# EAGLE design PhasedArrayTransmittor (EAGLE 9.5.2)
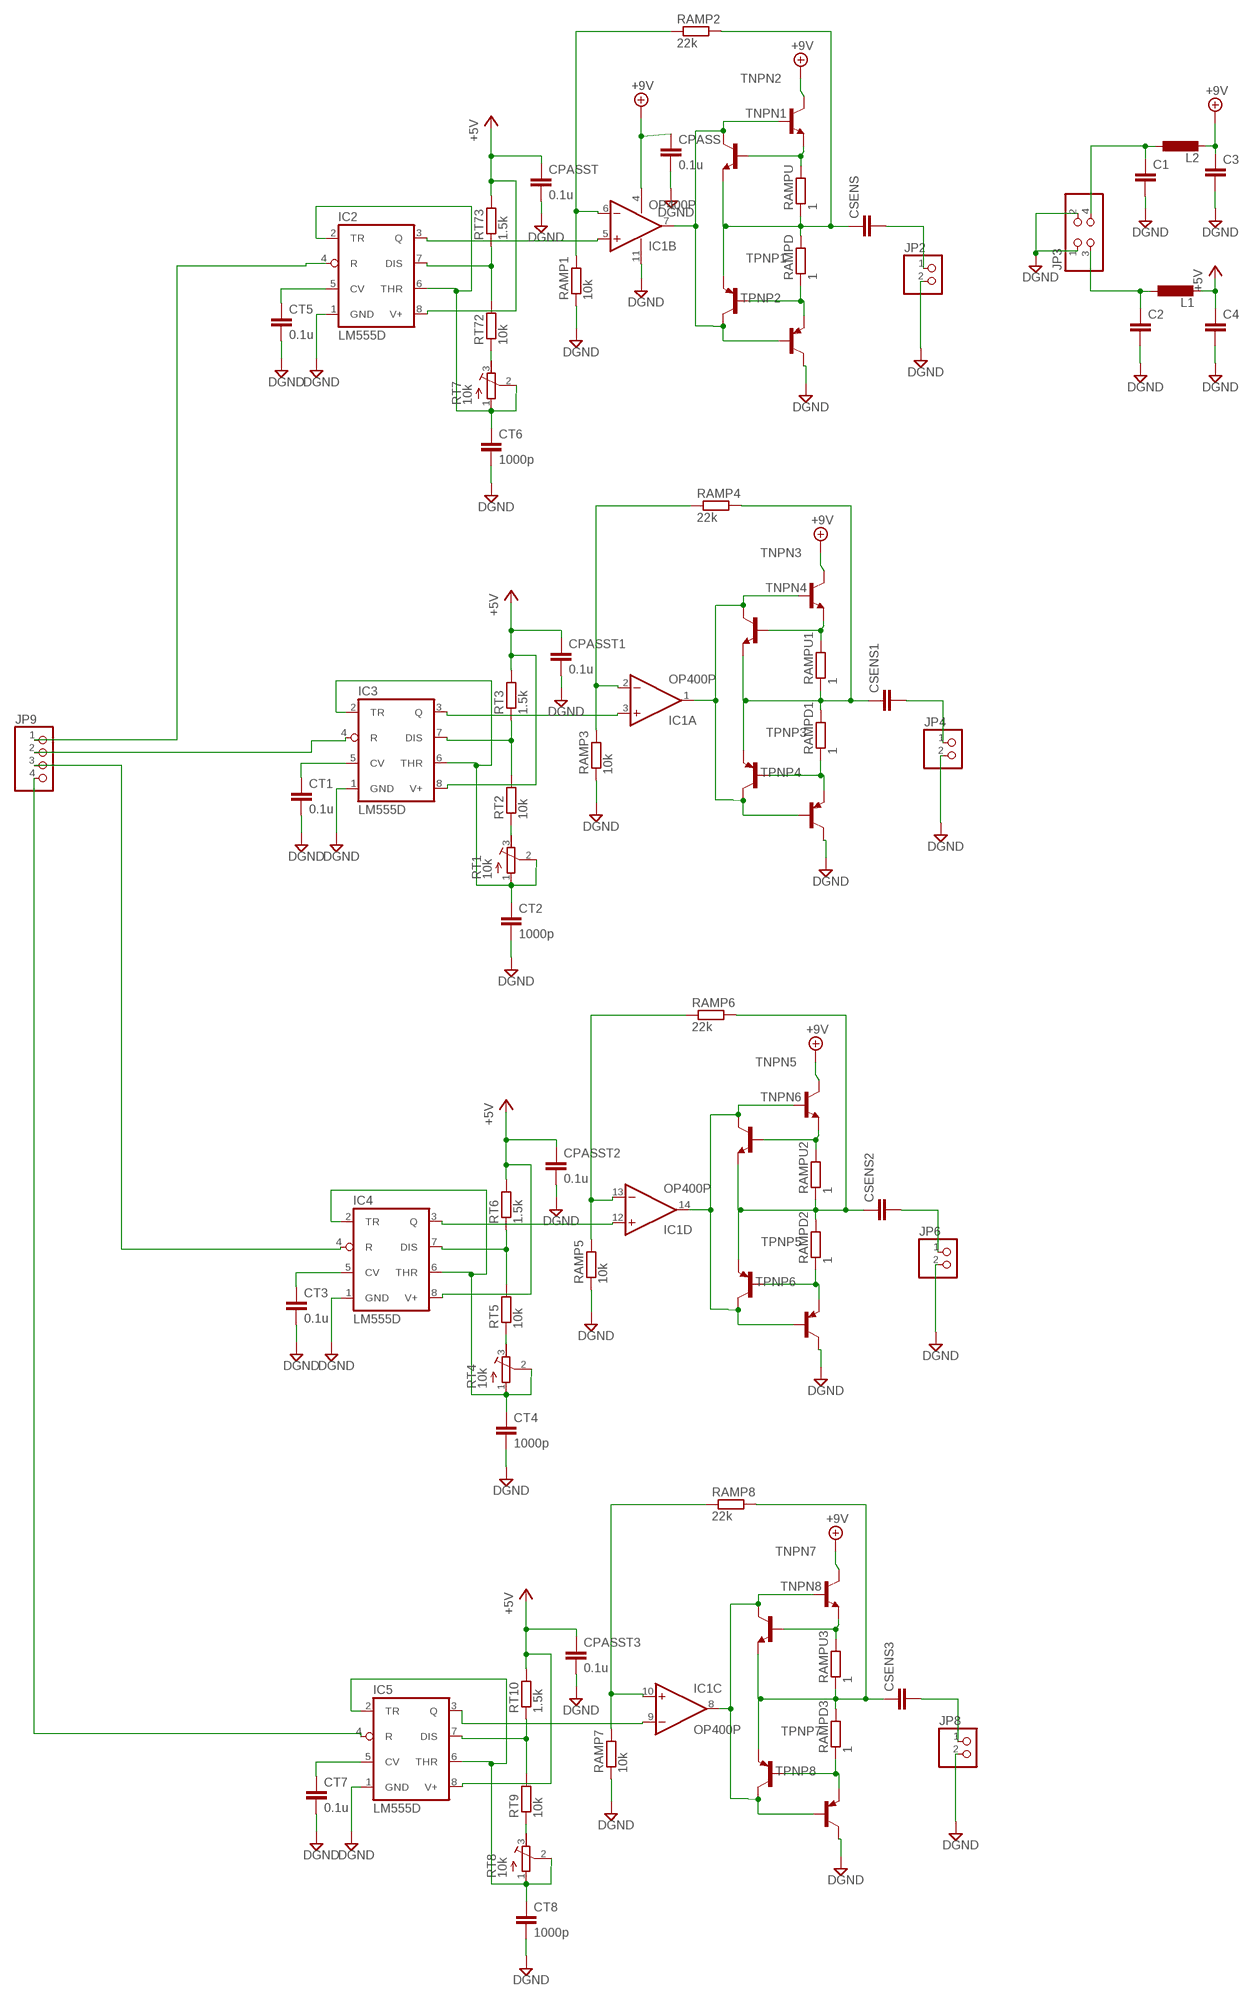
[diagram p0: schematic, sheet 1]

## Parts
C1  C-EU025-024X044  [C025-024X044]
C2  C-EU025-024X044  [C025-024X044]
C3  C-EU025-024X044  [C025-024X044]
C4  C-EU025-024X044  [C025-024X044]
CPASS  0.1u  C-EUC0603K  [C0603K]
CPASST  0.1u  C-EU025-024X044  [C025-024X044]
CPASST1  0.1u  C-EU025-024X044  [C025-024X044]
CPASST2  0.1u  C-EU025-024X044  [C025-024X044]
CPASST3  0.1u  C-EU025-024X044  [C025-024X044]
CSENS  C-EUC0603K  [C0603K]
CSENS1  C-EUC0603K  [C0603K]
CSENS2  C-EUC0603K  [C0603K]
CSENS3  C-EUC0603K  [C0603K]
CT1  0.1u  C-EU025-024X044  [C025-024X044]
CT2  1000p  C-EU025-024X044  [C025-024X044]
CT3  0.1u  C-EU025-024X044  [C025-024X044]
CT4  1000p  C-EU025-024X044  [C025-024X044]
CT5  0.1u  C-EU025-024X044  [C025-024X044]
CT6  1000p  C-EU025-024X044  [C025-024X044]
CT7  0.1u  C-EU025-024X044  [C025-024X044]
CT8  1000p  C-EU025-024X044  [C025-024X044]
IC1  OP400P  [DIL14]
IC2  LM555D  [SO08]
IC3  LM555D  [SO08]
IC4  LM555D  [SO08]
IC5  LM555D  [SO08]
JP2  PINHD-1X2  [1X02]
JP3  PINHD-2X2  [2X02]
JP4  PINHD-1X2  [1X02]
JP6  PINHD-1X2  [1X02]
JP8  PINHD-1X2  [1X02]
JP9  PINHD-1X4  [1X04]
L1  L-EU0207/7  [0207/7]
L2  L-EU0207/7  [0207/7]
RAMP1  10k  R-EU_R0603  [R0603]
RAMP2  22k  R-EU_R0603  [R0603]
RAMP3  10k  R-EU_R0603  [R0603]
RAMP4  22k  R-EU_R0603  [R0603]
RAMP5  10k  R-EU_R0603  [R0603]
RAMP6  22k  R-EU_R0603  [R0603]
RAMP7  10k  R-EU_R0603  [R0603]
RAMP8  22k  R-EU_R0603  [R0603]
RAMPD  1  R-EU_R0603  [R0603]
RAMPD1  1  R-EU_R0603  [R0603]
RAMPD2  1  R-EU_R0603  [R0603]
RAMPD3  1  R-EU_R0603  [R0603]
RAMPU  1  R-EU_R0603  [R0603]
RAMPU1  1  R-EU_R0603  [R0603]
RAMPU2  1  R-EU_R0603  [R0603]
RAMPU3  1  R-EU_R0603  [R0603]
RT1  10k  R-TRIMM74W  [RTRIM74W]
RT2  10k  R-EU_R0603  [R0603]
RT3  1.5k  R-EU_R0603  [R0603]
RT4  10k  R-TRIMM74W  [RTRIM74W]
RT5  10k  R-EU_R0603  [R0603]
RT6  1.5k  R-EU_R0603  [R0603]
RT7  10k  R-TRIMM74W  [RTRIM74W]
RT8  10k  R-TRIMM74W  [RTRIM74W]
RT9  10k  R-EU_R0603  [R0603]
RT10  1.5k  R-EU_R0603  [R0603]
RT72  10k  R-EU_R0603  [R0603]
RT73  1.5k  R-EU_R0603  [R0603]
TNPN1  BC817-16-NPN-SOT23-BEC  [SOT23-BEC]
TNPN2  BC817-16-NPN-SOT23-BEC  [SOT23-BEC]
TNPN3  BC817-16-NPN-SOT23-BEC  [SOT23-BEC]
TNPN4  BC817-16-NPN-SOT23-BEC  [SOT23-BEC]
TNPN5  BC817-16-NPN-SOT23-BEC  [SOT23-BEC]
TNPN6  BC817-16-NPN-SOT23-BEC  [SOT23-BEC]
TNPN7  BC817-16-NPN-SOT23-BEC  [SOT23-BEC]
TNPN8  BC817-16-NPN-SOT23-BEC  [SOT23-BEC]
TPNP1  BC807-16-PNP-SOT23-BEC  [SOT23-BEC]
TPNP2  BC807-16-PNP-SOT23-BEC  [SOT23-BEC]
TPNP3  BC807-16-PNP-SOT23-BEC  [SOT23-BEC]
TPNP4  BC807-16-PNP-SOT23-BEC  [SOT23-BEC]
TPNP5  BC807-16-PNP-SOT23-BEC  [SOT23-BEC]
TPNP6  BC807-16-PNP-SOT23-BEC  [SOT23-BEC]
TPNP7  BC807-16-PNP-SOT23-BEC  [SOT23-BEC]
TPNP8  BC807-16-PNP-SOT23-BEC  [SOT23-BEC]

## Nets
+5V [power]: C4.1 CPASST1.1 CPASST2.1 CPASST3.1 CPASST.1 IC2.8(V+) IC3.8(V+) IC4.8(V+) IC5.8(V+) L1.2 RT3.2 RT6.2 RT10.2 RT73.2
+9V [power]: C3.1 CPASS.1 IC1.4(P:V+) L2.2 TNPN2.C TNPN3.C TNPN5.C TNPN7.C
DGND [power]: C1.2 C2.2 C3.2 C4.2 CPASS.2 CPASST1.2 CPASST2.2 CPASST3.2 CPASST.2 CT1.2 CT2.2 CT3.2 CT4.2 CT5.2 CT6.2 CT7.2 CT8.2 IC1.11(P:V-) IC2.1(GND) IC3.1(GND) IC4.1(GND) IC5.1(GND) JP2.2 JP3.1 JP3.2 JP4.2 JP6.2 JP8.2 RAMP1.1 RAMP3.1 RAMP5.1 RAMP7.1 TPNP2.C TPNP4.C TPNP6.C TPNP8.C
N$1: RT1.3(E) RT2.1
N$2: CT5.1 IC2.5(CV)
N$3: RT7.3(E) RT72.1
N$4: IC1.6(B:-IN) RAMP1.2 RAMP2.1
N$5: IC2.7(DIS) RT72.2 RT73.1
N$6: IC5.4(R) JP9.4
N$7: IC1.7(B:OUT) TNPN1.C TNPN2.B TPNP1.C TPNP2.B
N$8: CT6.1 IC2.2(TR) IC2.6(THR) RT7.1(A) RT7.2(S)
N$9: IC3.7(DIS) RT2.2 RT3.1
N$10: RAMPD.1 TPNP1.B TPNP2.E
N$11: IC4.4(R) JP9.3
N$12: CT2.1 IC3.2(TR) IC3.6(THR) RT1.1(A) RT1.2(S)
N$13: RAMPU.2 TNPN1.B TNPN2.E
N$14: CSENS.1 RAMP2.2 RAMPD.2 RAMPU.1 TNPN1.E TPNP1.E
N$15: IC1.2(A:-IN) RAMP3.2 RAMP4.1
N$16: CSENS.2 JP2.1
N$17: RAMPU1.2 TNPN3.E TNPN4.B
N$18: IC1.1(A:OUT) TNPN3.B TNPN4.C TPNP3.C TPNP4.B
N$19: RAMPD1.1 TPNP3.B TPNP4.E
N$20: CSENS1.1 RAMP4.2 RAMPD1.2 RAMPU1.1 TNPN4.E TPNP3.E
N$21: CSENS1.2 JP4.1
N$22: CT1.1 IC3.5(CV)
N$23: RT4.3(E) RT5.1
N$24: IC4.7(DIS) RT5.2 RT6.1
N$25: IC3.4(R) JP9.2
N$26: CT4.1 IC4.2(TR) IC4.6(THR) RT4.1(A) RT4.2(S)
N$27: IC1.13(D:-IN) RAMP5.2 RAMP6.1
N$28: RAMPU2.2 TNPN5.E TNPN6.B
N$29: IC1.14(D:OUT) TNPN5.B TNPN6.C TPNP5.C TPNP6.B
N$30: RAMPD2.1 TPNP5.B TPNP6.E
N$31: CSENS2.1 RAMP6.2 RAMPD2.2 RAMPU2.1 TNPN6.E TPNP5.E
N$32: CSENS2.2 JP6.1
N$33: CT3.1 IC4.5(CV)
N$34: RT8.3(E) RT9.1
N$35: IC5.7(DIS) RT9.2 RT10.1
N$36: IC2.4(R) JP9.1
N$37: CT8.1 IC5.2(TR) IC5.6(THR) RT8.1(A) RT8.2(S)
N$38: IC1.10(C:+IN) RAMP7.2 RAMP8.1
N$39: RAMPU3.2 TNPN7.E TNPN8.B
N$40: IC1.8(C:OUT) TNPN7.B TNPN8.C TPNP7.C TPNP8.B
N$41: RAMPD3.1 TPNP7.B TPNP8.E
N$42: CSENS3.1 RAMP8.2 RAMPD3.2 RAMPU3.1 TNPN8.E TPNP7.E
N$43: CSENS3.2 JP8.1
N$44: CT7.1 IC5.5(CV)
N$45: IC1.5(B:+IN) IC2.3(Q)
N$46: IC1.3(A:+IN) IC3.3(Q)
N$47: IC1.12(D:+IN) IC4.3(Q)
N$48: IC1.9(C:-IN) IC5.3(Q)
N$49: C2.1 JP3.3 L1.1
N$51: C1.1 JP3.4 L2.1

## Library data of the parts
C1-C4 CPASS CPASST CPASST1-CPASST3 CSENS CSENS1-CSENS3 CT1-CT8 = rcl:C-EU: CAPACITOR, European symbol; SPICEPREFIX: C
IC1 = linear:OP400: OP AMP
IC2-IC5 = linear:*555: TIMER
JP2 JP4 JP6 JP8 = pinhead:PINHD-1X2: PIN HEADER
JP3 = pinhead:PINHD-2X2: PIN HEADER
JP9 = pinhead:PINHD-1X4: PIN HEADER
L1 L2 = rcl:L-EU: INDUCTOR, European symbol; SPICEPREFIX: L
RAMP1-RAMP8 RAMPD RAMPD1-RAMPD3 RAMPU RAMPU1-RAMPU3 RT2 RT3 RT5 RT6 RT9 RT10 RT72 RT73 = rcl:R-EU_: RESISTOR, European symbol; SPICEPREFIX: R
RT1 RT4 RT7 RT8 = rcl:R-TRIMM: Trimm resistor; SPICEMODEL: X; SPICEPREFIXL: POT
TNPN1-TNPN8 = transistor:*-NPN-: NPN Transistror BF959 corrected 2008.03.06
TPNP1-TPNP8 = transistor:*-PNP-: PNP Transistror

## Net classes
0 default: width 0.61 mm, clearance 0.203 mm
1 power: width 0.914 mm, clearance 0.254 mm

## Board
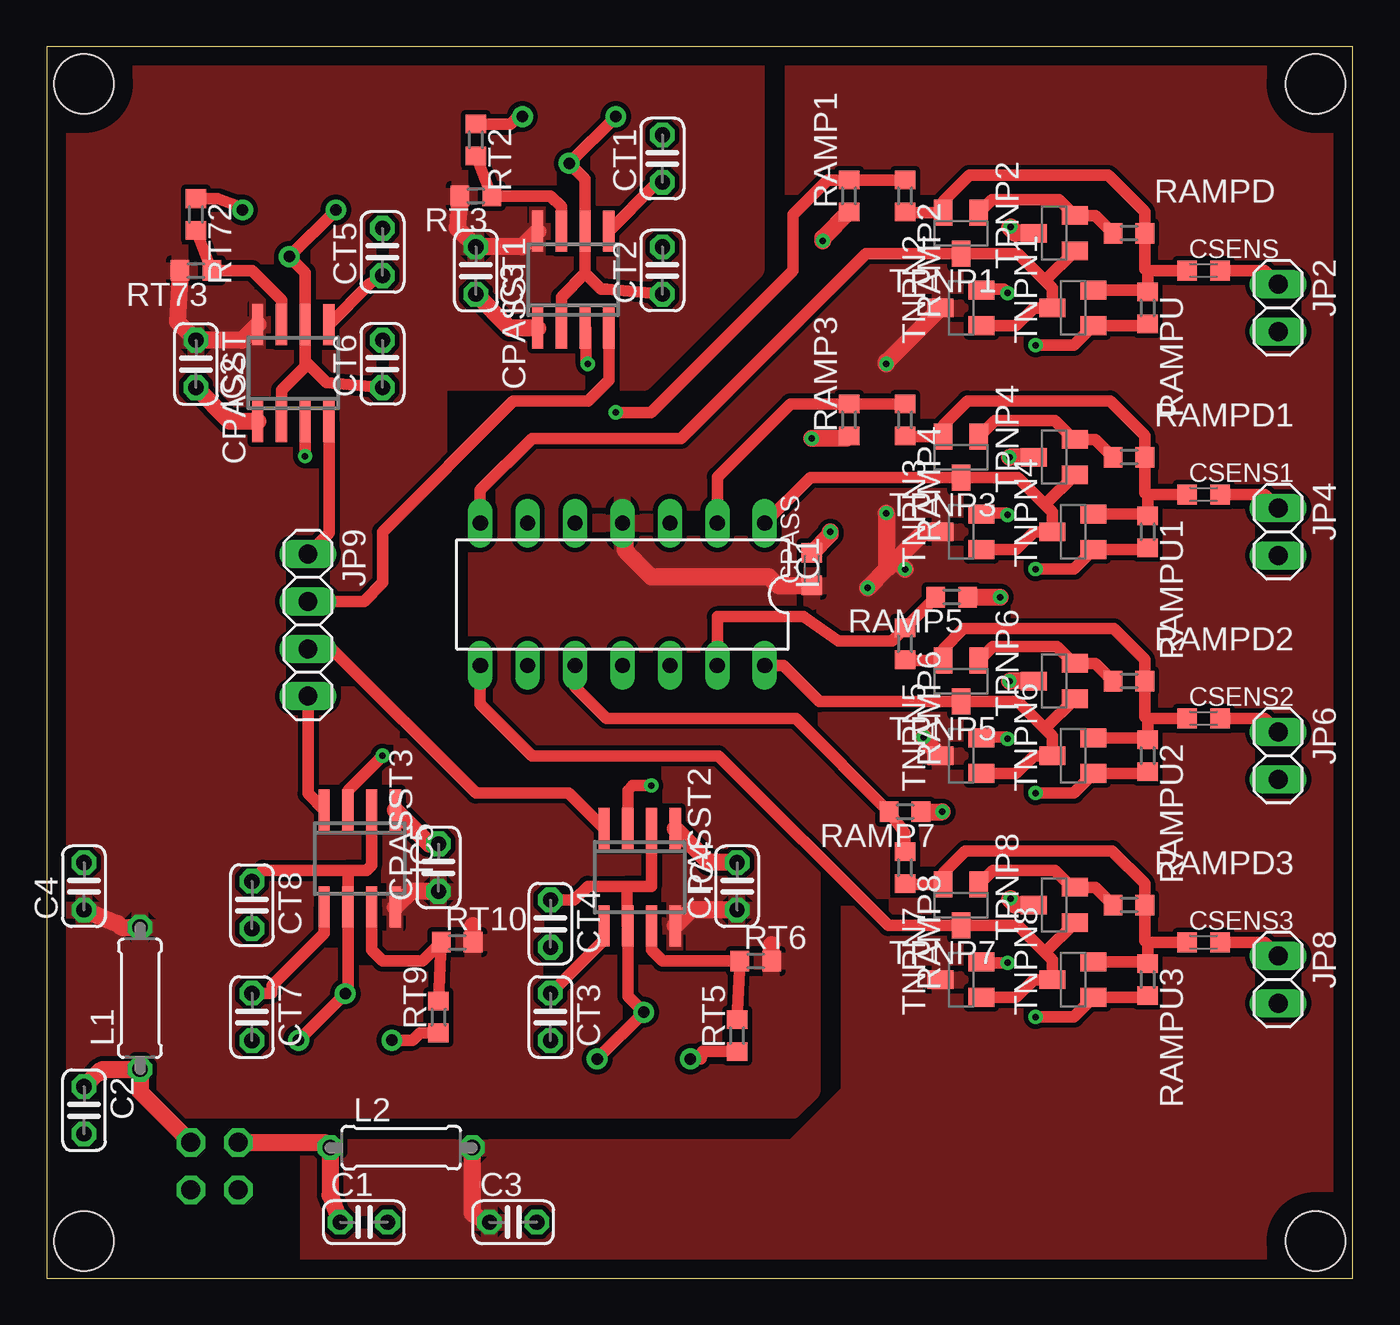
[diagram p1: board, top side]
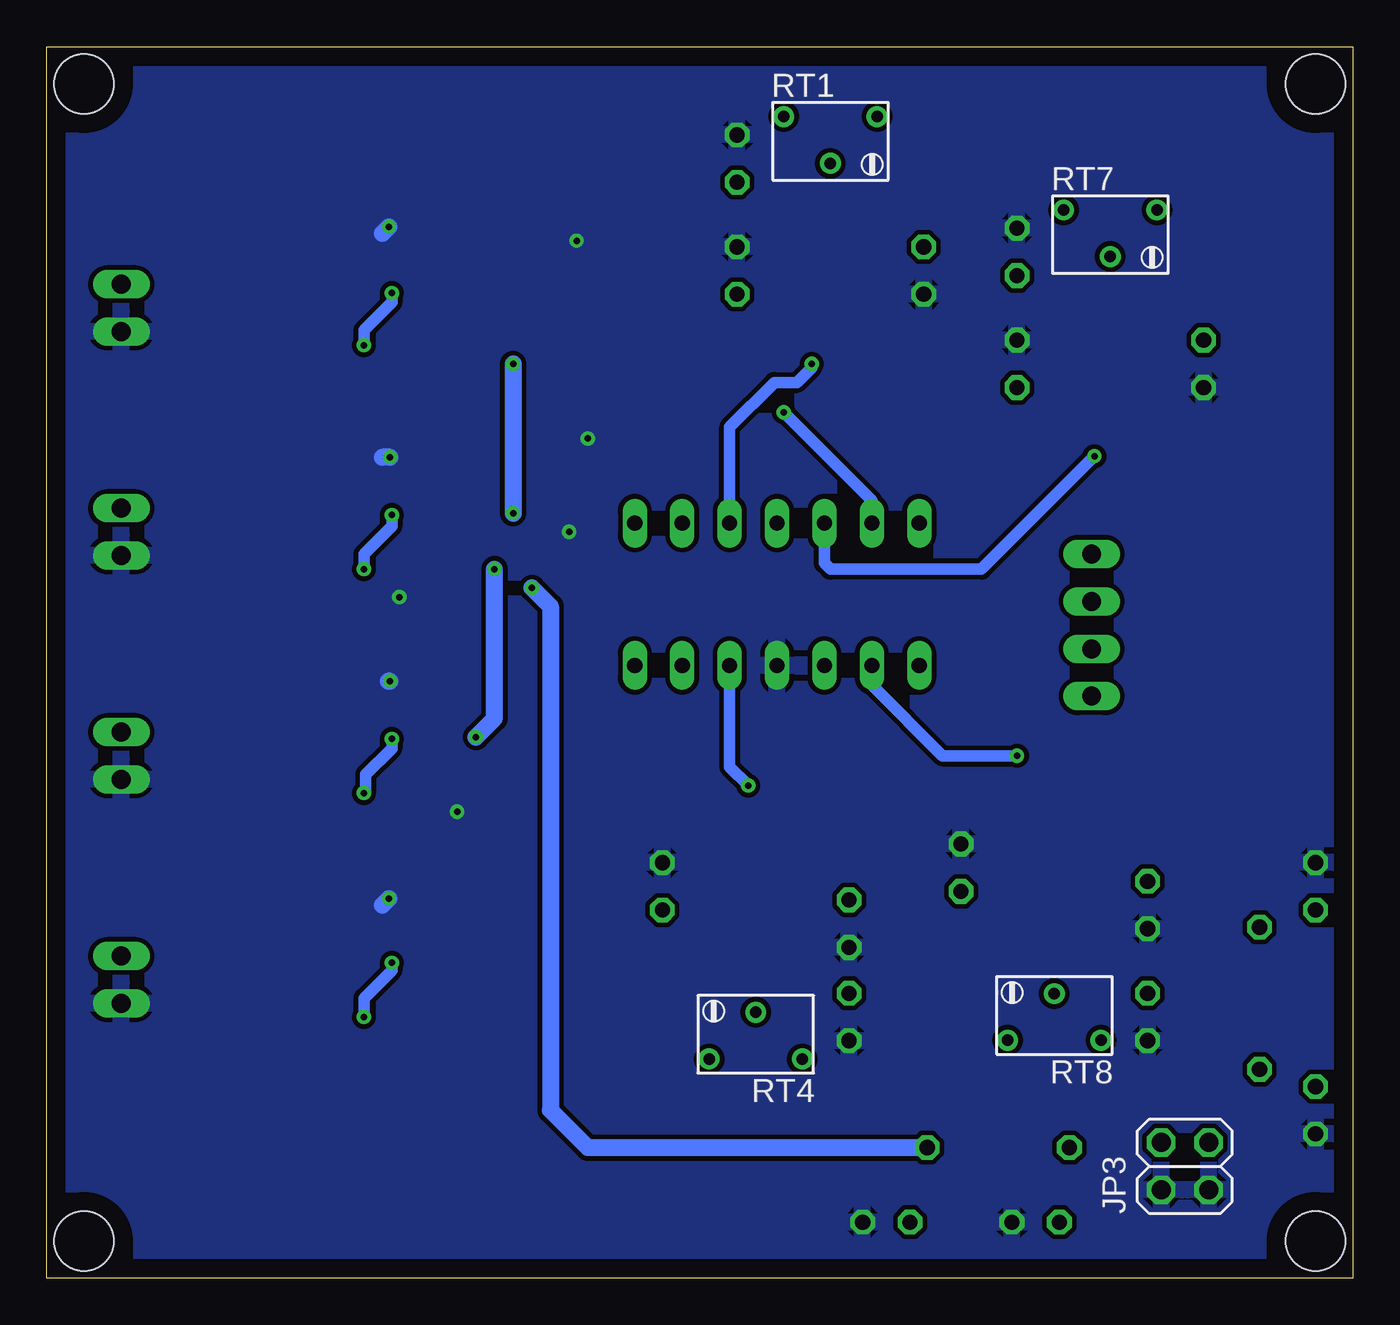
[diagram p2: board, bottom side, seen from below]

Size 70 x 66 mm. Coordinates in mm from the lower left corner, seen from the top.
Outline: 0,0 70,0 70,66 0,66 0,0
Copper layers (1*16): Top 0.035mm / dielectric 1.5mm / Bottom 0.035mm
Design rules "default": minimum track width 6mil, minimum drill 0.35mm, track to track 6mil, track to pad 6mil, pad to pad 6mil, via to via 6mil, smd to smd 6mil, copper to edge 40mil, drill to drill 6mil, minimum pad ring 10mil, minimum via ring 8mil, stop-mask expansion 4mil, vias tented up to drill 0mil, thermal gap 10mil
Holes 3.2 mm at 2,2 68,2 68,64 2,64

### Footprints (pad centres in the part's own frame; a part is rotated, then mirrored left to right if it is on the bottom)
C025-024X044 = drill 0.813 octagon: 1 -1.27,0; 2 1.27,0
C0603K = smd 1.05 x 1.08: 1 -0.875,0; 2 0.875,0
DIL14 = drill 0.813 long: 1 -7.62,-3.81; 2 -5.08,-3.81; 3 -2.54,-3.81; 4 0,-3.81; 5 2.54,-3.81; 6 5.08,-3.81; 7 7.62,-3.81; 8 7.62,3.81; 9 5.08,3.81; 10 2.54,3.81; 11 0,3.81; 12 -2.54,3.81; 13 -5.08,3.81; 14 -7.62,3.81
SO08 = smd 0.6 x 2.2: 1 -1.905,-2.6; 2 -0.635,-2.6; 3 0.635,-2.6; 4 1.905,-2.6; 5 1.905,2.6; 6 0.635,2.6; 7 -0.635,2.6; 8 -1.905,2.6
1X02 = drill 1.016 long: 1 -1.27,0; 2 1.27,0
2X02 = drill 1.016 octagon: 1 -1.27,-1.27; 2 -1.27,1.27; 3 1.27,-1.27; 4 1.27,1.27
1X04 = drill 1.016 long: 1 -3.81,0; 2 -1.27,0; 3 1.27,0; 4 3.81,0
0207/7 = drill 0.813 octagon: 1 -3.81,0; 2 3.81,0
R0603 = smd 1 x 1.1: 1 -0.85,0; 2 0.85,0
RTRIM74W = drill 0.61: 1 -1.25,-2.5; 2 1.25,0; 3 -1.25,2.5
SOT23-BEC = smd 1 x 1.4: B -0.95,-1.1; C 0,1.1; E 0.95,-1.1

### Placement (x,y rotation side)
C1  17,3 0 top
C2  2,9 270 top
C3  25,3 0 top
C4  2,21 90 top
CPASS  41,38 90 top
CPASST  8,49 270 top
CPASST1  23,54 270 top
CPASST2  37,21 90 top
CPASST3  21,22 90 top
CSENS  62,54 0 top
CSENS1  62,42 0 top
CSENS2  62,30 0 top
CSENS3  62,18 0 top
CT1  33,60 90 top
CT2  33,54 90 top
CT3  27,14 270 top
CT4  27,19 270 top
CT5  18,55 90 top
CT6  18,49 90 top
CT7  11,14 270 top
CT8  11,20 270 top
IC1  30.86,36.65 180 top
IC2  13.22,48.51 0 top
IC3  28.22,53.51 0 top
IC4  31.78,21.49 180 top
IC5  16.78,22.49 180 top
JP2  66,52 270 top
JP3  9,6 90 bottom
JP4  66,40 270 top
JP6  66,28 270 top
JP8  66,16 270 top
JP9  14,35 270 top
L1  5,15 90 top
L2  19,7 0 top
RAMP1  43,58 90 top
RAMP2  46,58 270 top
RAMP3  43,46 90 top
RAMP4  46,46 270 top
RAMP5  48.5,36.5 180 top
RAMP6  46,34 270 top
RAMP7  46,25 180 top
RAMP8  46,22 270 top
RAMPD  58,56 0 top
RAMPD1  58,44 0 top
RAMPD2  58,32 0 top
RAMPD3  58,20 0 top
RAMPU  59,52 270 top
RAMPU1  59,40 270 top
RAMPU2  59,28 270 top
RAMPU3  59,16 270 top
RT1  28,61 270 bottom
RT2  23,61 270 top
RT3  23,58 180 top
RT4  32,13 90 bottom
RT5  37,13 90 top
RT6  38,17 0 top
RT7  13,56 270 bottom
RT8  16,14 90 bottom
RT9  21,14 90 top
RT10  22,18 0 top
RT72  8,57 270 top
RT73  8,54 180 top
TNPN1  55,52 90 top
TNPN2  49,52 90 top
TNPN3  49,40 90 top
TNPN4  55,40 90 top
TNPN5  49,28 90 top
TNPN6  55,28 90 top
TNPN7  49,16 90 top
TNPN8  55,16 90 top
TPNP1  49,56 180 top
TPNP2  54,56 90 top
TPNP3  49,44 180 top
TPNP4  54,44 90 top
TPNP5  49,32 180 top
TPNP6  54,32 90 top
TPNP7  49,20 180 top
TPNP8  54,20 90 top

### Tracks (layer width: path | path; a pad name or v marks a point on that pad's centre or on a via)
+5V
  Top 0.914: RT73.2 7,51.27 CPASST.1 10.48,50.27 IC2.8 | RT3.2 22,56.27 CPASST1.1 25.48,55.27 IC3.8 | RT6.2 38.85,17.88 | RT10.2 22.85,18.88 | C4.1 3.81,19 4,18.81 L1.2 | CPASST3.1 19.52,20.73 IC5.8 | CPASST2.1 34.52,19.73 IC4.8
  pour Top: 0,66 38,66 38,54 33,49 32,48 21,48 21,31 25,27 26,27 36,27 41,22 41,12 41,10 40,9 0,9
+9V  (via drill 0.35)
  Top 0.914: TNPN3.C 47,40 45.5,38.5 | L2.2 22.81,3.46 C3.1 | IC1.4 31,40.32 31,39 32.4,37.6 38.7,37.6 39.17,37.12 CPASS.1 | TNPN2.C 45,49.1 v45,49 | v45,41 45,38 | 45,38 v44,37 | 45.5,38.5 45,38 | TNPN5.C 47,28.9 v47,29 | v46,38 45.5,38.5
  Bottom 0.914: L2.2 41,7 43,9 43,36 v44,37 | v45,49 v45,41 | v47,29 46,30 v46,38
  pour Top: 40,66 40,54 32,46 24,46 23,45 23,32 26,29 36,29 43,22 43,10 40,7 14,7 14,1 15,0 70,0 70,66
DGND  (via drill 0.35)
  Top 0.914: RAMP1.1 41.6,55.75 v41.6,55.6 | RAMP3.1 42.85,45 v41,45 | RAMP5.1 v51.1,36.5 | RAMP7.1 v48,25 | CPASS.2 42,39.88 v42,40 | TPNP4.C v51.6,44 | TPNP6.C v51.6,32 | TPNP8.C 51.9,20 51.6,20.3 v51.65,20.35 | TPNP2.C 51.9,56 51.6,56.3 v51.65,56.35 | IC3.1 24.82,50.91 CPASST1.2 | IC2.1 9.82,45.91 CPASST.2 | IC5.1 20.51,23.27 CPASST3.2 | CPASST2.2 35.51,22.27 IC4.1
  Bottom 0.914: v51.6,44 52,44 | v51.6,32 51.7,32 | v51.65,20.35 52,20 | v51.65,56.35 52,56
  pour Bottom: 0,66 0,0 70,0 70,66
N$1
  Top 0.61: RT1.3 25.38,62.38 24.85,61.85 RT2.1
N$2
  Top 0.61: IC2.5 17.32,53.3 CT5.1
N$3
  Top 0.61: RT72.1 9.17,57.85 10.5,57.38 RT7.3
N$4  (via drill 0.35)
  Top 0.61: RAMP2.1 RAMP1.2 41.85,58.85 40,57 40,54 32.4,46.4 v30.5,46.4
  Bottom 0.61: v30.5,46.4 25.78,41.68 IC1.6
N$5
  Top 0.61: IC2.7 12.59,52.41 11,54 RT73.1 RT72.2
N$6
  Top 0.61: IC5.4 14,25.96 JP9.4
N$7
  Top 0.61: TNPN2.B 51.95,51.05 52.9,52 TNPN1.C 53.9,53.05 53.5,53.45 | 53.5,53.45 52.05,54.9 TPNP1.C 43.9,54.9 34,45 26,45 23.24,42.24 IC1.7 | TPNP2.B 53.5,53.45
N$8
  Top 0.61: IC2.6 13.86,53.9 RT7.2 RT7.1 | IC2.6 13.86,49.15 15,48 CT6.1 | IC2.6 13.86,48.85 12.59,47.59 IC2.2
N$9
  Top 0.61: IC3.7 27.59,57.41 27,58 RT3.1 RT2.2
N$10
  Top 0.61: RAMPD.1 56.2,56.95 TPNP2.E 54.25,57.8 50.65,57.8 TPNP1.B
N$11
  Top 0.61: IC4.4 27.97,26 23,26 15.27,33.73 JP9.3
N$12
  Top 0.61: CT2.1 30,53 29.71,53 28.85,53.85 | IC3.2 27.59,52.59 28.85,53.85 | RT1.1 RT1.2 28.85,58.89 IC3.6 28.85,53.85
N$13  (via drill 0.35)
  Top 0.61: RAMPU.2 58.9,51.05 TNPN1.B 55.05,50 v53,50 | TNPN2.E 50.15,53 51.3,53 v51.5,52.8
  Bottom 0.61: v51.5,52.8 51.5,52.3 53,50.8 v53,50
N$14
  Top 0.61: 59,54 RAMPU.1 58.9,52.95 TNPN1.E | 59,54 58.85,54.06 RAMPD.2 58.85,57.15 56.89,59.11 49.44,59.11 48.05,57.72 TPNP1.E 45.95,57.1 RAMP2.2 | CSENS.1 59,54
N$15
  Top 0.61: RAMP4.1 RAMP3.2 39.85,46.85 35.94,42.94 IC1.2
N$16
  Top 0.61: CSENS.2 65.27,54 JP2.1
N$17  (via drill 0.35)
  Top 0.61: RAMPU1.2 58.9,39.05 TNPN4.B 55.05,38 v53,38 | TNPN3.E 50.15,41 51.4,41 v51.5,40.9
  Bottom 0.61: v51.5,40.9 51.5,40.3 53,38.8 v53,38
N$18
  Top 0.61: TNPN3.B 51.95,39.05 52.9,40 TNPN4.C 53.9,41.05 53.5,41.45 | 53.5,41.45 52.05,42.9 TPNP3.C 40.92,42.9 IC1.1 | TPNP4.B 53.5,41.45
N$19
  Top 0.61: RAMPD1.1 56.2,44.95 TPNP4.E 55.04,44.95 54.03,45.96 50.81,45.96 TPNP3.B
N$20
  Top 0.61: 59,42 RAMPU1.1 58.9,40.95 TNPN4.E | 59,42 58.85,42.06 RAMPD1.2 58.85,45.15 56.99,47.01 49.34,47.01 48.05,45.72 TPNP3.E 45.95,45.1 RAMP4.2 | CSENS1.1 59,42
N$21
  Top 0.61: CSENS1.2 65.27,42 JP4.1
N$22
  Top 0.61: CT1.1 32.73,58.46 32.58,58.56 IC3.5
N$23
  Top 0.61: RT4.3 35.07,11.75 35.15,12.15 RT5.1
N$24
  Top 0.61: RT5.2 RT6.1 33,17 32.41,17.59 IC4.7
N$25
  Top 0.61: IC3.4 30.12,48.12 29,47 25,47 18,40 18,37.27 17,36.27 JP9.2
N$26
  Top 0.61: RT4.1 RT4.2 31.15,15.11 IC4.6 31.1,18.93 31.1,21 | CT4.1 28.27,20.27 29,21 31.1,21 | 31.1,21 32.41,21 IC4.2
N$27
  Top 0.61: IC1.13 35.94,35.45 40.57,35.45 42.43,34.15 45,34.15 45.23,34.15 45.24,34.16 45.31,34.16 RAMP6.1 RAMP5.2
N$28  (via drill 0.35)
  Top 0.61: RAMPU2.2 58.9,27.05 TNPN6.B 55.05,26 v53,26 | TNPN5.E 50.15,29 51.4,29 v51.5,28.9
  Bottom 0.61: v51.5,28.9 51.5,28.4 52.9,27 52.9,26.1 v53,26
N$29
  Top 0.61: TNPN5.B 51.95,27.05 52.9,28 TNPN6.C 53.9,29.05 53.5,29.45 | 53.5,29.45 52.05,30.9 TPNP5.C 41.42,30.9 39.48,32.84 IC1.14 | TPNP6.B 53.5,29.45
N$30
  Top 0.61: RAMPD2.1 56.2,32.95 TPNP6.E 55.04,32.95 54.13,33.86 50.71,33.86 TPNP5.B
N$31
  Top 0.61: 59,30 RAMPU2.1 58.9,28.95 TNPN6.E | 59,30 58.85,30.06 RAMPD2.2 58.85,33.15 57.19,34.81 49.14,34.81 48.05,33.72 TPNP5.E 45.95,33.1 RAMP6.2 | CSENS2.1 59,30
N$32
  Top 0.61: CSENS2.2 65.27,30 JP6.1
N$33
  Top 0.61: CT3.1 29.87,18.14 29.88,18.15 IC4.5
N$34
  Top 0.61: RT8.3 19.6,12.75 20,13.15 RT9.1
N$35
  Top 0.61: RT9.2 RT10.1 20.15,17 18,17 17.41,17.59 IC5.7
N$36
  Top 0.61: IC2.4 15.12,39.94 JP9.1
N$37
  Top 0.61: RT8.1 RT8.2 16.15,15.39 IC5.6 16.15,21.86 | 16.15,21.86 17.16,21.86 17.41,22.11 IC5.2 | CT8.1 11.59,21.86 16.15,21.86
N$38
  Top 0.61: RAMP8.1 46,23.85 RAMP7.2 40.15,30 30,30 28.32,31.68 IC1.10
N$39  (via drill 0.35)
  Top 0.61: RAMPU3.2 58.9,15.05 TNPN8.B 55.05,14 v53,14 | v51.5,16.9 50.15,16.9 TNPN7.E
  Bottom 0.61: v51.5,16.9 51.5,16.5 53,15 v53,14
N$40
  Top 0.61: TNPN7.B 51.95,15.05 52.9,16 TNPN8.C 53.9,17.05 53.5,17.45 | 53.5,17.45 52.05,18.9 TPNP7.C 45.1,18.9 36,28 26,28 23.24,30.76 IC1.8 | TPNP8.B 53.5,17.45
N$41
  Top 0.61: RAMPD3.1 56.2,20.95 TPNP8.E 54.9,21.15 54.74,21.15 54.03,21.86 50.71,21.86 TPNP7.B
N$42
  Top 0.61: 59,18 RAMPU3.1 58.9,16.95 TNPN8.E | 59,18 58.85,18.06 RAMPD3.2 58.85,21.15 57.09,22.91 49.24,22.91 48.05,21.72 TPNP7.E 45.95,21.1 RAMP8.2 | CSENS3.1 59,18
N$43
  Top 0.61: CSENS3.2 65.27,18 JP8.1
N$44
  Top 0.61: CT7.1 12.05,15.27 12.09,15.68 14.88,18.47 IC5.5
N$45  (via drill 0.35)
  Top 0.61: IC2.3 13.86,44.15 13.9,44.1 v13.85,44.05
  Bottom 0.61: v13.85,44.05 19.9,38 28,38 28.32,38.32 IC1.5
N$46  (via drill 0.35)
  Top 0.61: v29,49 28.9,49.1 28.9,50.87 IC3.3
  Bottom 0.61: IC1.3 33.4,45.6 31,48 29.8,48 29,48.8 v29,49
N$47  (via drill 0.35)
  Top 0.61: IC4.3 31.15,26.15 31.4,26.4 v32.4,26.4
  Bottom 0.61: IC1.12 33.4,27.4 v32.4,26.4
N$48  (via drill 0.35)
  Top 0.61: v18,28 16.15,26.15 IC5.3
  Bottom 0.61: IC1.9 25.78,31.78 22,28 v18,28
N$49
  Top 0.914: JP3.3 5,10 L1.1 3,11.19 2.81,11 2.82,11.09 C2.1
N$51
  Top 0.914: JP3.4 14.92,7.27 L2.1 15.19,4.46 C1.1